# Altium schematic sheet MB1312.SchDoc: TOP & POWER
size A4; DocumentNumber: MB1312; Revision: A-01; SheetNumber: 1; SheetTotal: 6; Project: NUCLEO-LXXXZX
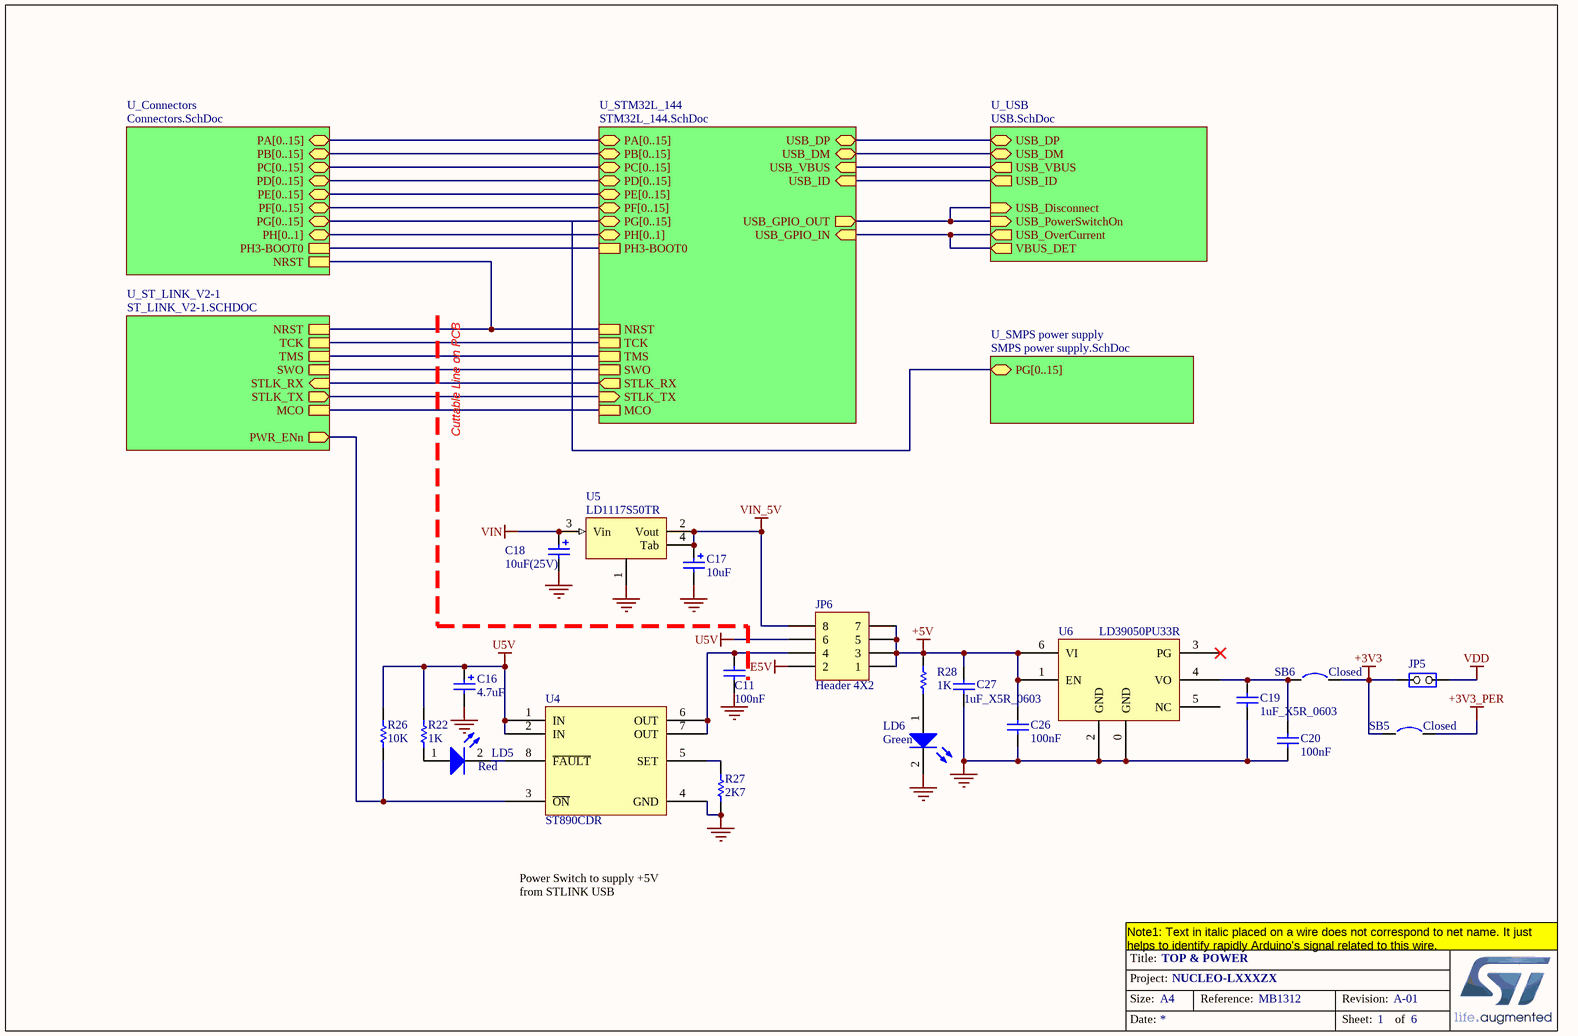
[diagram p0: MB1312.SchDoc]

## Parts
C11  100nF  [0603C]
C16  4.7uF  [TAN-A]
C17  10uF  [TAN-A]
C18  10uF(25V)  [TAN-B]
C19  1uF_X5R_0603  [0603C]
C20  100nF  [0603C]
C26  100nF  [0603C]
C27  1uF_X5R_0603  [0603C]
JP5  (no value)  [HDR_1x2_2R54_V_M_S]
JP6  Header 4X2  [HDR_4x2_2R54_V_M]
LD5  Red  [0603D-R]
LD6  Green  [0603D-G]
R22  1K  [0603R]
R26  10K  [0603R]
R27  2K7  [0603R]
R28  1K  [0603R]
SB5  Closed  [SB_0603]
SB6  Closed  [SB_0603]
U4  ST890CDR  [SOIC8_1R27_4R9X6]
U5  LD1117S50TR  [SOT-223]
U6  LD39050PU33R  [DFN6_0R95_3x3_TP]

## Sub-sheets
U_Connectors = Connectors.SchDoc: PA[0..15] (bidir), PB[0..15] (bidir), PC[0..15] (bidir), NRST, PH3-BOOT0, PD[0..15] (bidir), PE[0..15] (bidir), PF[0..15] (bidir), PG[0..15] (bidir), PH[0..1] (bidir)
U_SMPS power supply = SMPS power supply.SchDoc: PG[0..15] (bidir)
U_ST_LINK_V2-1 = ST_LINK_V2-1.SCHDOC: TMS, TCK, MCO, NRST, STLK_RX (in), STLK_TX (out), SWO, PWR_ENn (out)
U_STM32L_144 = STM32L_144.SchDoc: NRST, MCO, STLK_TX (in), STLK_RX (out), PA[0..15] (bidir), PB[0..15] (bidir), PC[0..15] (bidir), TCK, TMS, SWO, PH3-BOOT0, PD[0..15] (bidir), PE[0..15] (bidir), PF[0..15] (bidir), PG[0..15] (bidir), PH[0..1] (bidir), USB_DM (bidir), USB_DP (bidir), USB_GPIO_OUT (out), USB_GPIO_IN (in), USB_ID (in), USB_VBUS (in)
U_USB = USB.SchDoc: USB_PowerSwitchOn (in), USB_OverCurrent (out), USB_DM (bidir), USB_DP (bidir), USB_ID (out), USB_VBUS (out), USB_Disconnect (in), VBUS_DET (out)

## Nets
+3V3: JP5.1(COMMON) SB5.1 SB6.2
+3V3_PER: SB5.2
+5V: C26.2 C27.1 JP6.1 JP6.3 JP6.5 JP6.7 R28.2 U6.1(EN) U6.6(VI)
E5V: JP6.2
GND: C11.1 C16.2 C17.2 C18.2 C19.2 C20.1 C26.1 C27.2 LD6.2(K) R27.1 U4.4(GND) U5.1 U6.0(GND) U6.2(GND)
U5V: C16.1 JP6.6 R22.1 R26.1 U4.1(IN) U4.2(IN)
VDD: JP5.2(NO)
VIN: C18.1 U5.3(Vin)
VIN_5V: C17.1 JP6.8 U5.2(Vout) U5.4(Tab)
NetC11_2: C11.2 JP6.4 U4.6(OUT) U4.7(OUT)
NetC19_1: C19.1 C20.2 SB6.1 U6.4(VO)
NetLD5_1: LD5.1(A) R22.2
NetLD5_2: LD5.2(K) U4.8(~{FAULT})
NetLD6_1: LD6.1(A) R28.1
NetR26_2: R26.2 U4.3(~{ON}) ; sheet U_ST_LINK_V2-1/PWR_ENn
NetR27_2: R27.2 U4.5(SET)
(unnamed): sheet U_STM32L_144/NRST, sheet U_Connectors/NRST, sheet U_ST_LINK_V2-1/NRST
(unnamed): sheet U_STM32L_144/MCO, sheet U_ST_LINK_V2-1/MCO
(unnamed): sheet U_STM32L_144/STLK_TX, sheet U_ST_LINK_V2-1/STLK_TX
(unnamed): sheet U_STM32L_144/STLK_RX, sheet U_ST_LINK_V2-1/STLK_RX
(unnamed): sheet U_STM32L_144/TCK, sheet U_ST_LINK_V2-1/TCK
(unnamed): sheet U_STM32L_144/TMS, sheet U_ST_LINK_V2-1/TMS
(unnamed): sheet U_STM32L_144/SWO, sheet U_ST_LINK_V2-1/SWO
(unnamed): sheet U_STM32L_144/PH3-BOOT0, sheet U_Connectors/PH3-BOOT0
(unnamed): sheet U_STM32L_144/USB_DM, sheet U_USB/USB_DM
(unnamed): sheet U_STM32L_144/USB_DP, sheet U_USB/USB_DP
(unnamed): sheet U_STM32L_144/USB_GPIO_OUT, sheet U_USB/USB_PowerSwitchOn, sheet U_USB/USB_Disconnect
(unnamed): sheet U_STM32L_144/USB_GPIO_IN, sheet U_USB/USB_OverCurrent, sheet U_USB/VBUS_DET
(unnamed): sheet U_STM32L_144/USB_ID, sheet U_USB/USB_ID
(unnamed): sheet U_STM32L_144/USB_VBUS, sheet U_USB/USB_VBUS

Not connected (* = marked no-connect by the designer): U6 3(PG)* 5(NC)

## Buses and harness runs
bus sheet U_Connectors/PA[0..15] = sheet U_STM32L_144/PA[0..15]
bus sheet U_Connectors/PB[0..15] = sheet U_STM32L_144/PB[0..15]
bus sheet U_Connectors/PC[0..15] = sheet U_STM32L_144/PC[0..15]
bus sheet U_Connectors/PD[0..15] = sheet U_STM32L_144/PD[0..15]
bus sheet U_Connectors/PE[0..15] = sheet U_STM32L_144/PE[0..15]
bus sheet U_Connectors/PF[0..15] = sheet U_STM32L_144/PF[0..15]
bus sheet U_Connectors/PG[0..15] = sheet U_SMPS power supply/PG[0..15] = sheet U_STM32L_144/PG[0..15]
bus sheet U_Connectors/PH[0..1] = sheet U_STM32L_144/PH[0..1]

## Notes on the sheet
- Cuttable Line on PCB
- Power Switch to supply +5V from STLINK USB
- Note1: Text in italic placed on a wire does not correspond to net name. It just helps to identify rapidly Arduino's signal related to this wire.
- Title:
- Project:
- Size:
- Date:
- A4
- Reference:
- Sheet:
- Revision:
- of

## Library data of the parts
C11 C20 C26 = Capacitor_ST: Capacitor 0402 / 0603 / 0805; Revision: July-2002: Re-released for DXP Platform.; Value: 100nF
C16 = Cap Pol1: Polarized Capacitor (Radial); Value: 100pF; Ordered by: Subcon; Published: 8-Jun-2000; Revision: July-2002: Re-released for DXP Platform.; Publisher: Altium Limited
C17 C18 = Cap Pol1: Polarized Capacitor (Radial); Published: 8-Jun-2000; Revision: July-2002: Re-released for DXP Platform.; Publisher: Altium Limited; Value: 10uF
C19 C27 = CAP SMD 0603  X5R 1µF 25V 10%: 0603  X5R 1µF; Rated voltage: 25V; Tolerance: 10%; Manufacturer: *; Manufacturer P/N: *; Order code Farnell: 1288202RL; Value: 1µF; Power: *; Technology: X5R; Temperature  Factor: *; Temperature Max: +125°C; Temperature Min: -55°C; STS Code: *
JP5 = JP2
JP6 = Header 4X2: Header, 4-Pin, Dual row; Revision: 17-Jul-2002: Re-released for DXP Platform.; Publisher: Altium Limited
LD5 LD6 = LED2: Typical RED, GREEN, YELLOW, AMBER GaAs LED; Published: 8-Jun-2000; Revision: July-2002: Re-released for DXP Platform.; Publisher: Altium Limited
R22 = Res1: Resistor; Ordered by: Subcon; Published: 8-Jun-2000; Revision: July-2002: Re-released for DXP Platform.; Publisher: Altium Limited; Value: 1K
R26 = Resistor_ST: Resistor 0402 / 0603 / 0805; Description: Resistor 0402 or 0603 or 0805; Value: 10K
R27 R28 = Resistor_ST: Resistor 0402 / 0603 / 0805; Description: Resistor 0402 or 0603 or 0805; Value: 10K
SB5 SB6 = Circuit Breaker_close: Circuit Breaker; Published: 24-Mar-1999; Revision: July-2002: Re-released for DXP Platform.; Publisher: Altium Limited
U5 = LD1117
U6 = LD39050P